# EAGLE design TempSensorCircuit_v3 (EAGLE 9.5.1)

## Sheet 1 of 2
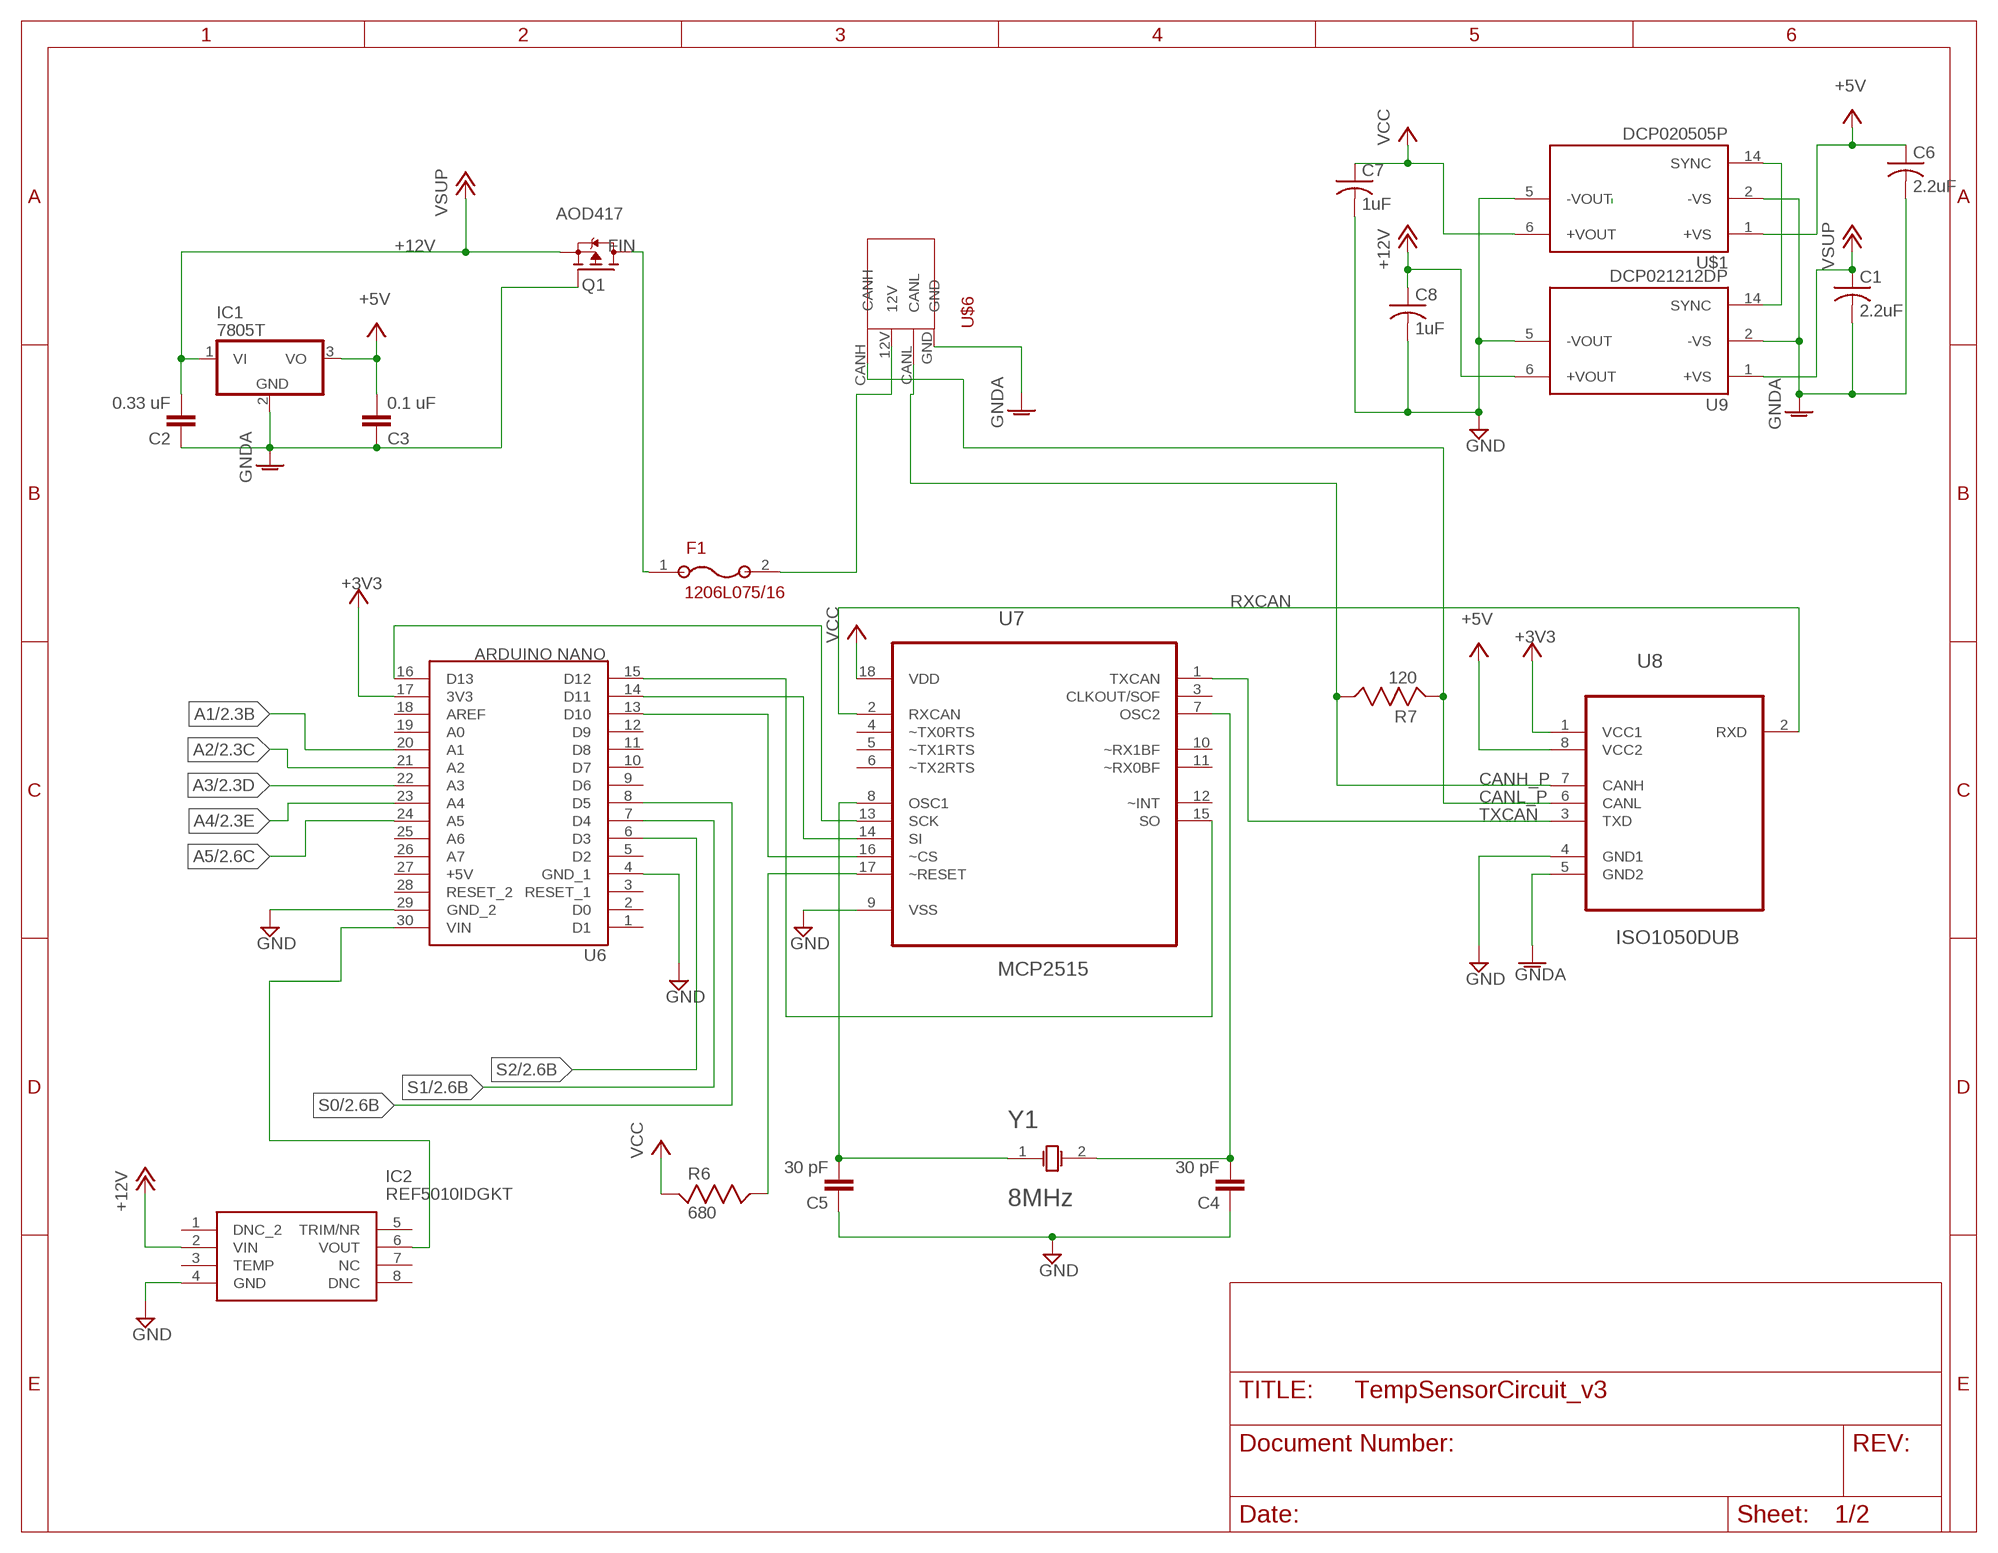
[diagram p0: schematic, sheet 1]

### Parts
C1  2.2uF  C-USC0805  [C0805]
C2  0.33 uF  C5/2.5  [C5B2.5]
C3  0.1 uF  C5/2.5  [C5B2.5]
C4  30 pF  C5/2.5  [C5B2.5]
C5  30 pF  C5/2.5  [C5B2.5]
C6  2.2uF  C-USC0805  [C0805]
C7  1uF  C-USC0805  [C0805]
C8  1uF  C-USC0805  [C0805]
F1  1206L075/16  [1206L075/16]
IC1  7805T  [TO220H]
IC2  REF5010IDGKT  [SOP65P490X110-8N]
Q1  AOD417  FDD4141TO252  [TO252]
R6  680  RC0805FR-0751K1L  [RESC2012X60]
R7  120  RC0805FR-0751K1L  [RESC2012X60]
U6  ARDUINO NANO  NANO  [NANO]
U7  MCP2515  MCP2515-I/P  [DIP254P762X432-18]
U8  ISO1050DUB  [SOP254P1040X485-8N]
U9  DCP021212DP  [DIP763W46P254L1969H533Q14]
U$1  DCP020505P  [DIP763W46P254L1969H533Q14]
U$6  0026013142-ND  [0026013142-ND]
Y1  8MHz  HC49/SLF  [XTAL_HC49P488W43L1135T465H360]

### Nets
+3V3: U6.17(3V3) U8.1(VCC1)
+5V: C3.2 C6.1 IC1.3(VO) U8.8(VCC2) U$1.1(+VS)
+12V: C1.1 C2.2 C8.1 IC1.1(VI) IC2.2(VIN) Q1.2(S) U9.1(+VS) U9.6(+VOUT) ; supply symbol labelled VSUP
A1: U6.20(A1) ; also sheet 2
A2: U6.21(A2) ; also sheet 2
A3: U6.22(A3) ; also sheet 2
A4: U6.23(A4) ; also sheet 2
A5: U6.24(A5) ; also sheet 2
CANH_P: R7.2 U8.7(CANH) U$6.CANL
CANL_P: R7.1 U8.6(CANL) U$6.CANH
FIN: F1.1 Q1.3(D)
GND: C4.1 C5.1 C7.2 C8.2 IC2.4(GND) U6.4(GND_1) U6.29(GND_2) U7.9(VSS) U8.4(GND1) U9.5(-VOUT) U$1.5(-VOUT) ; also sheet 2
GNDA: C1.2 C2.1 C3.1 C6.2 IC1.2(GND) Q1.1(G) U8.5(GND2) U9.2(-VS) U$1.2(-VS) U$6.GND
N$1: R6.2 U7.17(~RESET)
N$3: U6.16(D13) U7.13(SCK)
N$7: U6.14(D11) U7.14(SI)
N$8: U6.15(D12) U7.15(SO)
N$9: U6.13(D10) U7.16(~CS)
N$10: IC2.6(VOUT) U6.30(VIN)
N$18: F1.2 U$6.12V
N$53: U9.14(SYNC) U$1.14(SYNC)
OSC_N [DiffPair]: C5.2 U7.8(OSC1) Y1.1
OSC_P [DiffPair]: C4.2 U7.7(OSC2) Y1.2
RXCAN: U7.2(RXCAN) U8.2(RXD)
S0: U6.8(D5) ; also sheet 2
S1: U6.7(D4) ; also sheet 2
S2: U6.6(D3) ; also sheet 2
TXCAN: U7.1(TXCAN) U8.3(TXD)
VCC: C7.1 R6.1 U7.18(VDD) U$1.6(+VOUT) ; also sheet 2
Unconnected: IC2.1(DNC_2) IC2.3(TEMP) IC2.5(TRIM/NR) IC2.7(NC) IC2.8(DNC) U6.1(D1) U6.2(D0) U6.3(RESET_1) U6.5(D2) U6.9(D6) U6.10(D7) U6.11(D8) U6.12(D9) U6.18(AREF) U6.19(A0) U6.25(A6) U6.26(A7) U6.28(RESET_2) U7.3(CLKOUT/SOF) U7.4(~TX0RTS) U7.5(~TX1RTS) U7.6(~TX2RTS) U7.10(~RX1BF) U7.11(~RX0BF) U7.12(~INT)

## Sheet 2 of 2
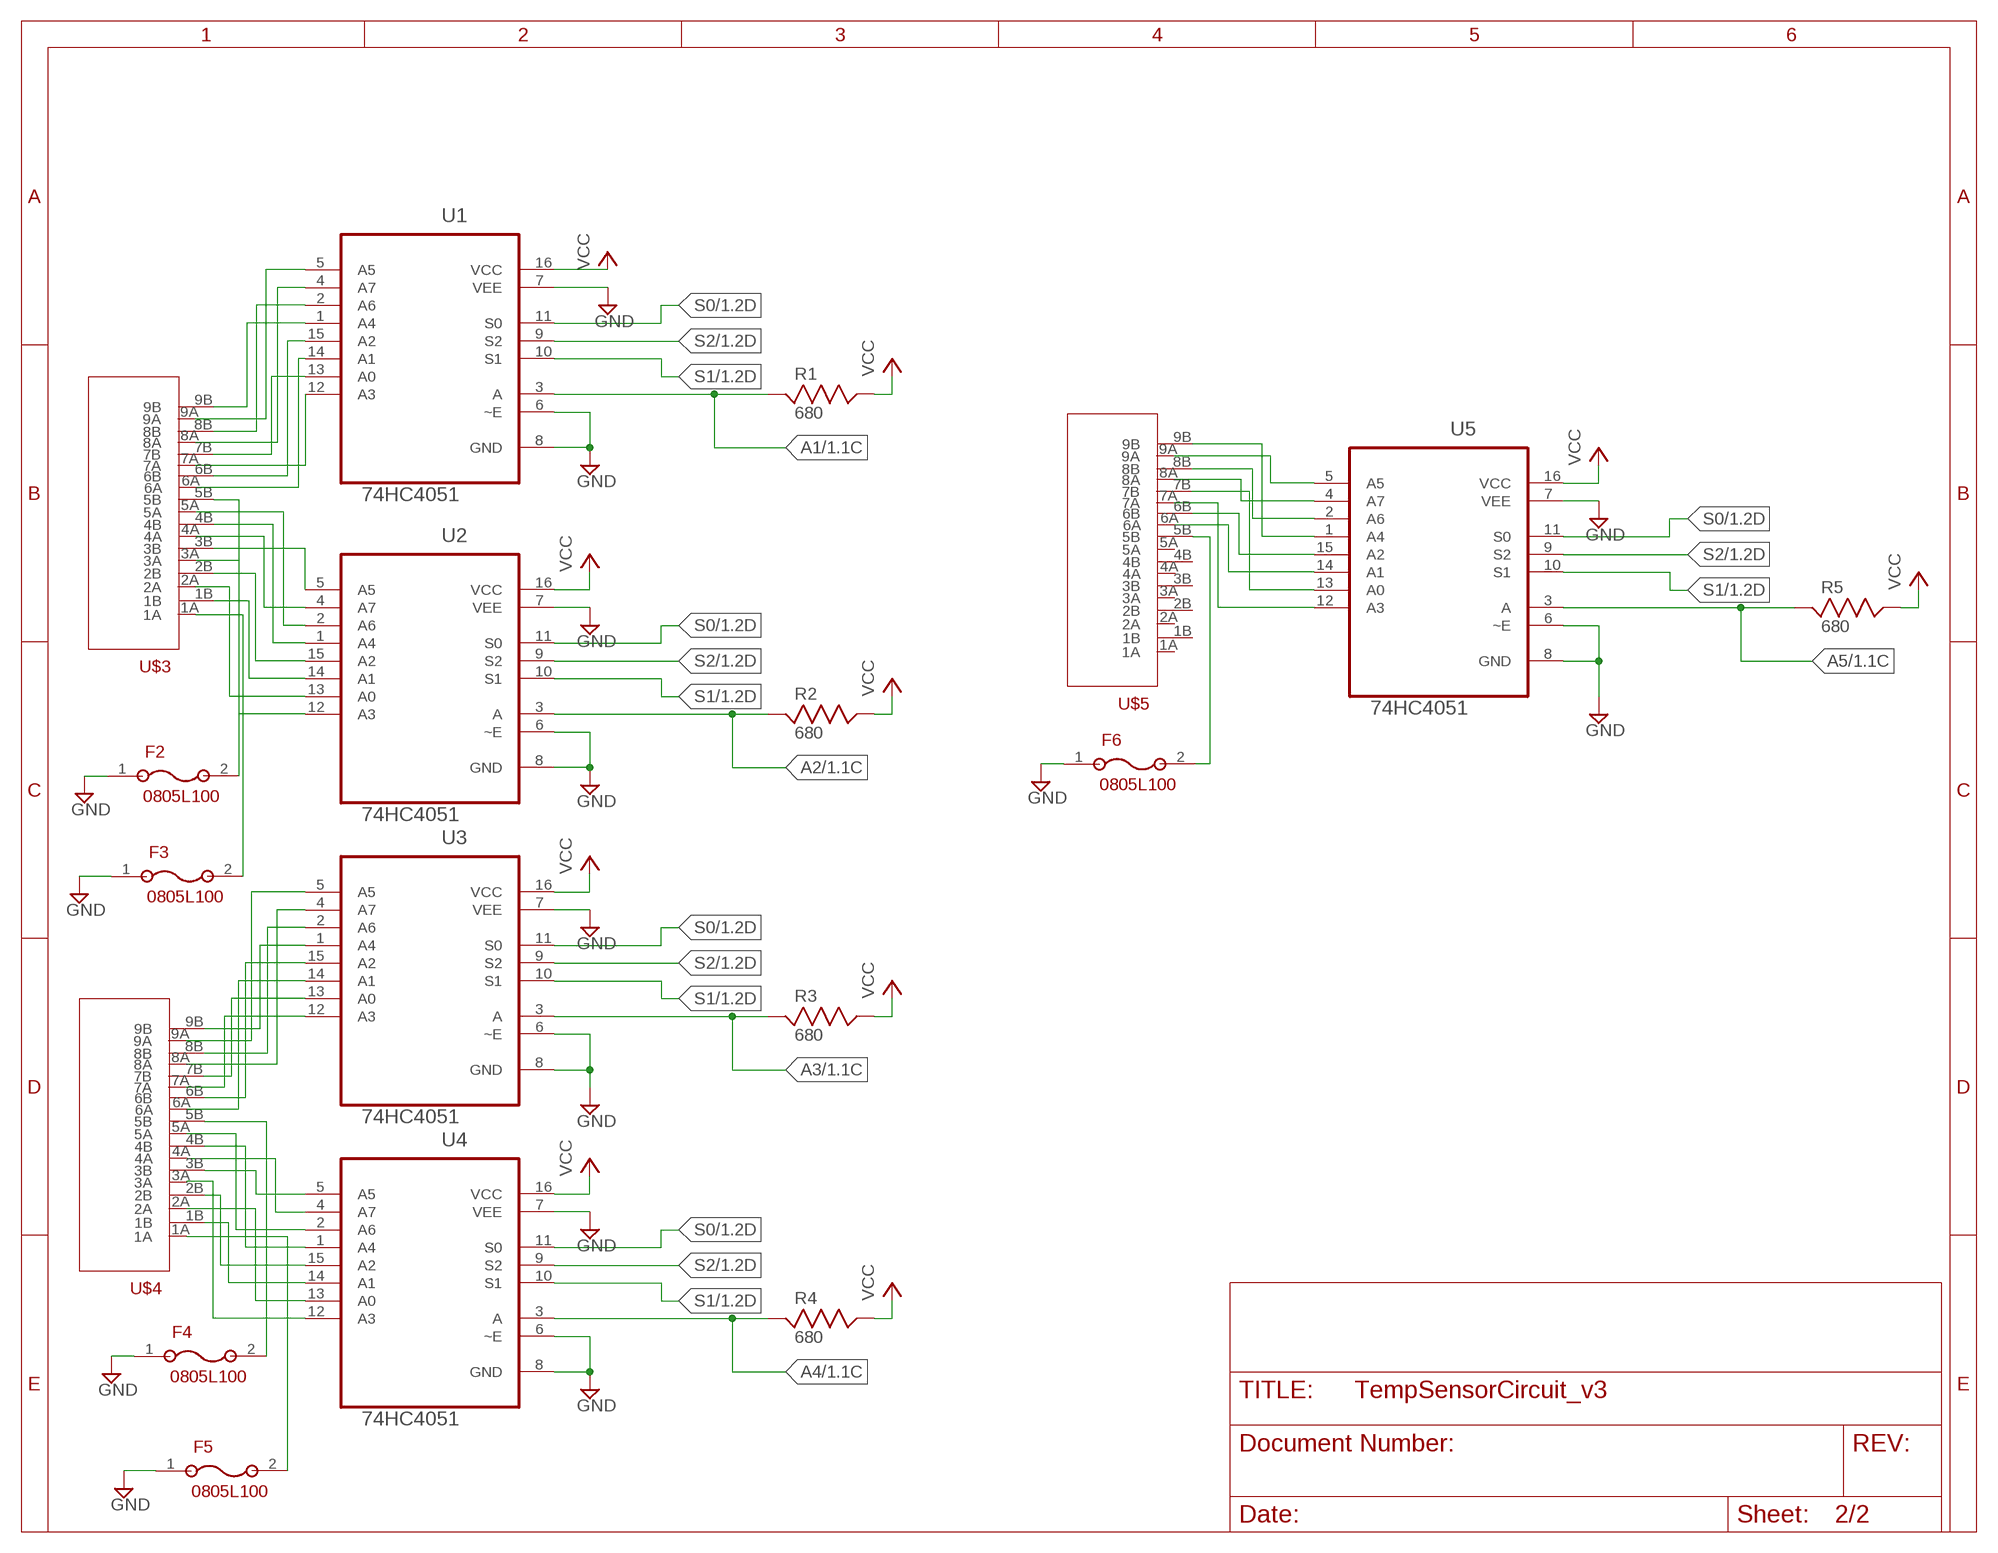
[diagram p1: schematic, sheet 2]

### Parts
F2  0805L100  [2012]
F3  0805L100  [2012]
F4  0805L100  [2012]
F5  0805L100  [2012]
F6  0805L100  [2012]
R1  680  RC0805FR-0751K1L  [RESC2012X60]
R2  680  RC0805FR-0751K1L  [RESC2012X60]
R3  680  RC0805FR-0751K1L  [RESC2012X60]
R4  680  RC0805FR-0751K1L  [RESC2012X60]
R5  680  RC0805FR-0751K1L  [RESC2012X60]
U1  74HC4051  CD74HC4051E  [DIP254P762X508-16]
U2  74HC4051  CD74HC4051E  [DIP254P762X508-16]
U3  74HC4051  CD74HC4051E  [DIP254P762X508-16]
U4  74HC4051  CD74HC4051E  [DIP254P762X508-16]
U5  74HC4051  CD74HC4051E  [DIP254P762X508-16]
U$3  WM1359-ND  [WM1359-ND]
U$4  WM1359-ND  [WM1359-ND]
U$5  WM1359-ND  [WM1359-ND]

### Nets
A1: R1.1 U1.3(A) ; also sheet 1
A2: R2.1 U2.3(A) ; also sheet 1
A3: R3.1 U3.3(A) ; also sheet 1
A4: R4.1 U4.3(A) ; also sheet 1
A5: R5.1 U5.3(A) ; also sheet 1
GND: F2.1 F3.1 F4.1 F5.1 F6.1 U1.6(~E) U1.7(VEE) U1.8(GND) U2.6(~E) U2.7(VEE) U2.8(GND) U3.6(~E) U3.7(VEE) U3.8(GND) U4.6(~E) U4.7(VEE) U4.8(GND) U5.6(~E) U5.7(VEE) U5.8(GND) ; also sheet 1
N$2: U1.1(A4) U$3.9B
N$4: U1.2(A6) U$3.8B
N$5: U1.5(A5) U$3.9A
N$6: U1.4(A7) U$3.8A
N$11: U1.15(A2) U$3.6B
N$12: U1.14(A1) U$3.6A
N$13: U1.13(A0) U$3.7B
N$14: U1.12(A3) U$3.7A
N$15: U2.2(A6) U$3.5A
N$16: U2.1(A4) U$3.4B
N$17: U2.4(A7) U$3.4A
N$19: U2.5(A5) U$3.3B
N$20: U2.15(A2) U$3.2B
N$21: U2.14(A1) U$3.1B
N$22: U2.12(A3) U$3.3A
N$23: U2.13(A0) U$3.2A
N$24: F2.2 U$3.5B
N$25: F3.2 U$3.1A
N$26: U3.1(A4) U$4.9B
N$27: U3.2(A6) U$4.8B
N$28: U3.4(A7) U$4.8A
N$29: U3.5(A5) U$4.9A
N$30: U3.15(A2) U$4.6B
N$31: U3.14(A1) U$4.6A
N$32: U3.13(A0) U$4.7B
N$33: U3.12(A3) U$4.7A
N$34: F4.2 U$4.5B
N$35: U4.1(A4) U$4.4B
N$36: U4.2(A6) U$4.5A
N$37: U4.4(A7) U$4.4A
N$38: U4.5(A5) U$4.3B
N$39: U4.15(A2) U$4.2B
N$40: U4.14(A1) U$4.1B
N$41: U4.13(A0) U$4.2A
N$42: U4.12(A3) U$4.3A
N$43: F5.2 U$4.1A
N$44: U5.1(A4) U$5.9B
N$45: U5.2(A6) U$5.8B
N$46: U5.4(A7) U$5.8A
N$47: U5.5(A5) U$5.9A
N$48: U5.15(A2) U$5.6B
N$49: U5.14(A1) U$5.6A
N$50: U5.13(A0) U$5.7B
N$51: U5.12(A3) U$5.7A
N$52: F6.2 U$5.5B
S0: U1.11(S0) U2.11(S0) U3.11(S0) U4.11(S0) U5.11(S0) ; also sheet 1
S1: U1.10(S1) U2.10(S1) U3.10(S1) U4.10(S1) U5.10(S1) ; also sheet 1
S2: U1.9(S2) U2.9(S2) U3.9(S2) U4.9(S2) U5.9(S2) ; also sheet 1
VCC: R1.2 R2.2 R3.2 R4.2 R5.2 U1.16(VCC) U2.16(VCC) U3.16(VCC) U4.16(VCC) U5.16(VCC) ; also sheet 1
Unconnected: U$5.1A U$5.1B U$5.2A U$5.2B U$5.3A U$5.3B U$5.4A U$5.4B U$5.5A

## Power pins joined to a net without a drawn wire
+5V: U6.27(+5V)

## Library data of the parts
C1 C6-C8 = rcl:C-US: CAPACITOR, American symbol; SPICEPREFIX: C
C2-C5 = capacitor-wima:C: CAPACITOR naming: grid - package width
F1 = 1206L:1206L075/16
F2-F6 = 0805L:0805L100
IC1 = linear:78*: Positive VOLTAGE REGULATOR Source: http://cache.national.com/ds/LM/LM78L05.pdf http://www.fairchildsemi.com/ds/LM/LM7805.pdf
IC2 = SamacSys_Parts:REF5010IDGKT: Low Noise, Very Low Drift, Precision Series Voltage Reference Source: Datasheet <http://www.ti.com/lit/gpn/ref5010>; DESCRIPTION: Low Noise, Very Low Drift, Precision Series Voltage Reference; HEIGHT: mm; MANUFACTURER_NAME: Texas Instruments; MANUFACTURER_PART_NUMBER: REF5010IDGKT; MOUSER_PART_NUMBER: 595-REF5010IDGKT; MOUSER_PRICE-STOCK: https://www.mouser.com/Search/Refine.aspx?Keyword=595-REF5010IDGKT
Q1 = AOD417:FDD4141: P-Channel PowerTrench® MOSFET Source: FDD4141.pdf; AVAILABILITY: Unavailable; DESCRIPTION: Transistor: P-MOSFET; unipolar; -40V; -50A; 69W; DPAK; MF: ON Semiconductor; MP: FDD4141; PACKAGE: TO-252-3 Fairchild Semiconductor; PRICE: None
R1-R7 = RC0805FR-0751K1L:RC0805FR-0751K1L: RC Series 0805 0.125 W 2 kOhms 5% ±100 ppm/°C SMT Thick Film Chip Resistor; AVAILABILITY: Unavailable; DESCRIPTION: Res Thick Film 2.0 x 1.2 mm 51.1K Ohm 1% 0.125W_1/8W_ 100ppm/ C Molded SMD Paper T/R; MF: Yageo; MP: RC0805FR-0751K1L; PACKAGE: 0805 Yageo; PRICE: None
U1-U5 = CD74HC4051E:CD74HC4051E: HIGH-SPEED CMOS LOGIC ANALOG MULTIPLEXERS/DEMULTIPLEXERS; AVAILABILITY: Unavailable; DESCRIPTION: High Speed CMOS 8-Channel Analog Multiplexer/Demultiplexer 16-PDIP -55 to 125; MF: Texas Instruments; MP: CD74HC4051E; PACKAGE: PDIP-16 Texas Instruments; PRICE: None
U6 = ArduinoNano:NANO: MICRO, ARDUINO NANO 3.0, MINI-B USB, ATmega328, 0.1"DIP, ICSP HDR; AVAILABILITY: Unavailable; DESCRIPTION: MICRO, ARDUINO NANO 3.0, MINI-B USB, ATmega328, 0.1DIP, ICSP HDR; MF: Arduino; MP: A000005; PACKAGE: None; PRICE: None
U7 = MCP2515-I_P:MCP2515-I/P: Stand-Alone CAN Controller; AVAILABILITY: Unavailable; DESCRIPTION: MCP2515 Series 5.5 V 1 Mb/s Stand Alone SPI Interface CAN Controller - PDIP-18; MF: Microchip; MP: MCP2515-I/P; PACKAGE: DIP-18 Microchip; PRICE: None
U8 = ISO1050DUB:ISO1050DUB: ISOLATED CAN TRANSCEIVER; AVAILABILITY: Unavailable; DESCRIPTION: Isolated 5-V CAN Transceivers 8-SOP -55 to 105; MF: Texas Instruments; MP: ISO1050DUB; PACKAGE: SOP-8 Texas Instruments; PRICE: None
U9 = DCP021212DP:DCP021212DP: Miniature, 2W Isolated Unregulated DC/DC Converters 7-PDIP -40 to 85; DESCRIPTION: Miniature, 2W Isolated Unregulated DC/DC Converters 7-PDIP -40 to 85; DIGI-KEY_PART_NUMBER: DCP021212DP-ND; DIGI-KEY_PURCHASE_URL: https://www.digikey.ca/product-detail/en/texas-instruments/DCP021212DP/DCP021212DP-ND/307873?utm_source=snapeda&utm_medium=aggregator&utm_campaign=symbol; MF: Texas Instruments; MP: DCP021212DP; PACKAGE: PDIP-7 Texas Instruments
U$1 = DCP021212DP:DCP020505P
U$3-U$5 = WM21358-ND:WM1359-ND
U$6 = WM21358-ND:0026013142-ND
Y1 = XTAL_HC49P488W43L1135T465H360:HC49/SLF

## Net classes
0 default: width 0.5 mm, clearance 0.2 mm
1 DiffPair: width 0.305 mm, clearance 0.2 mm

## Board
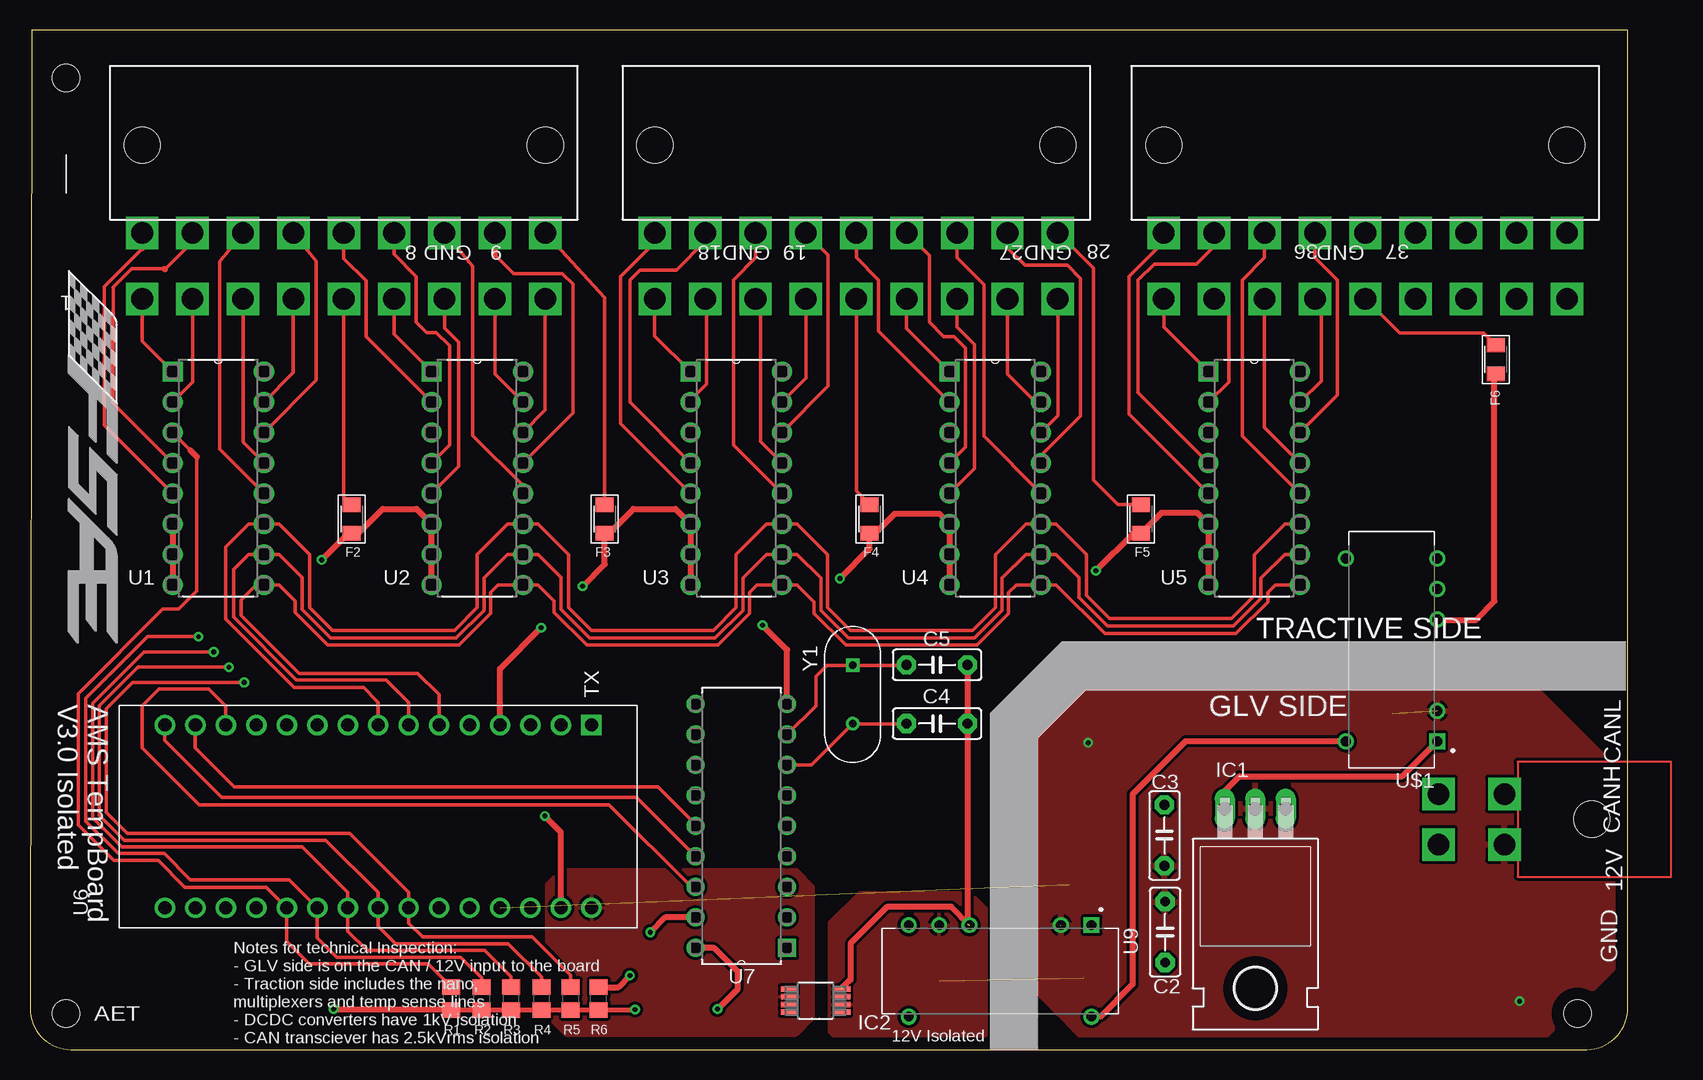
[diagram p2: board, top side]
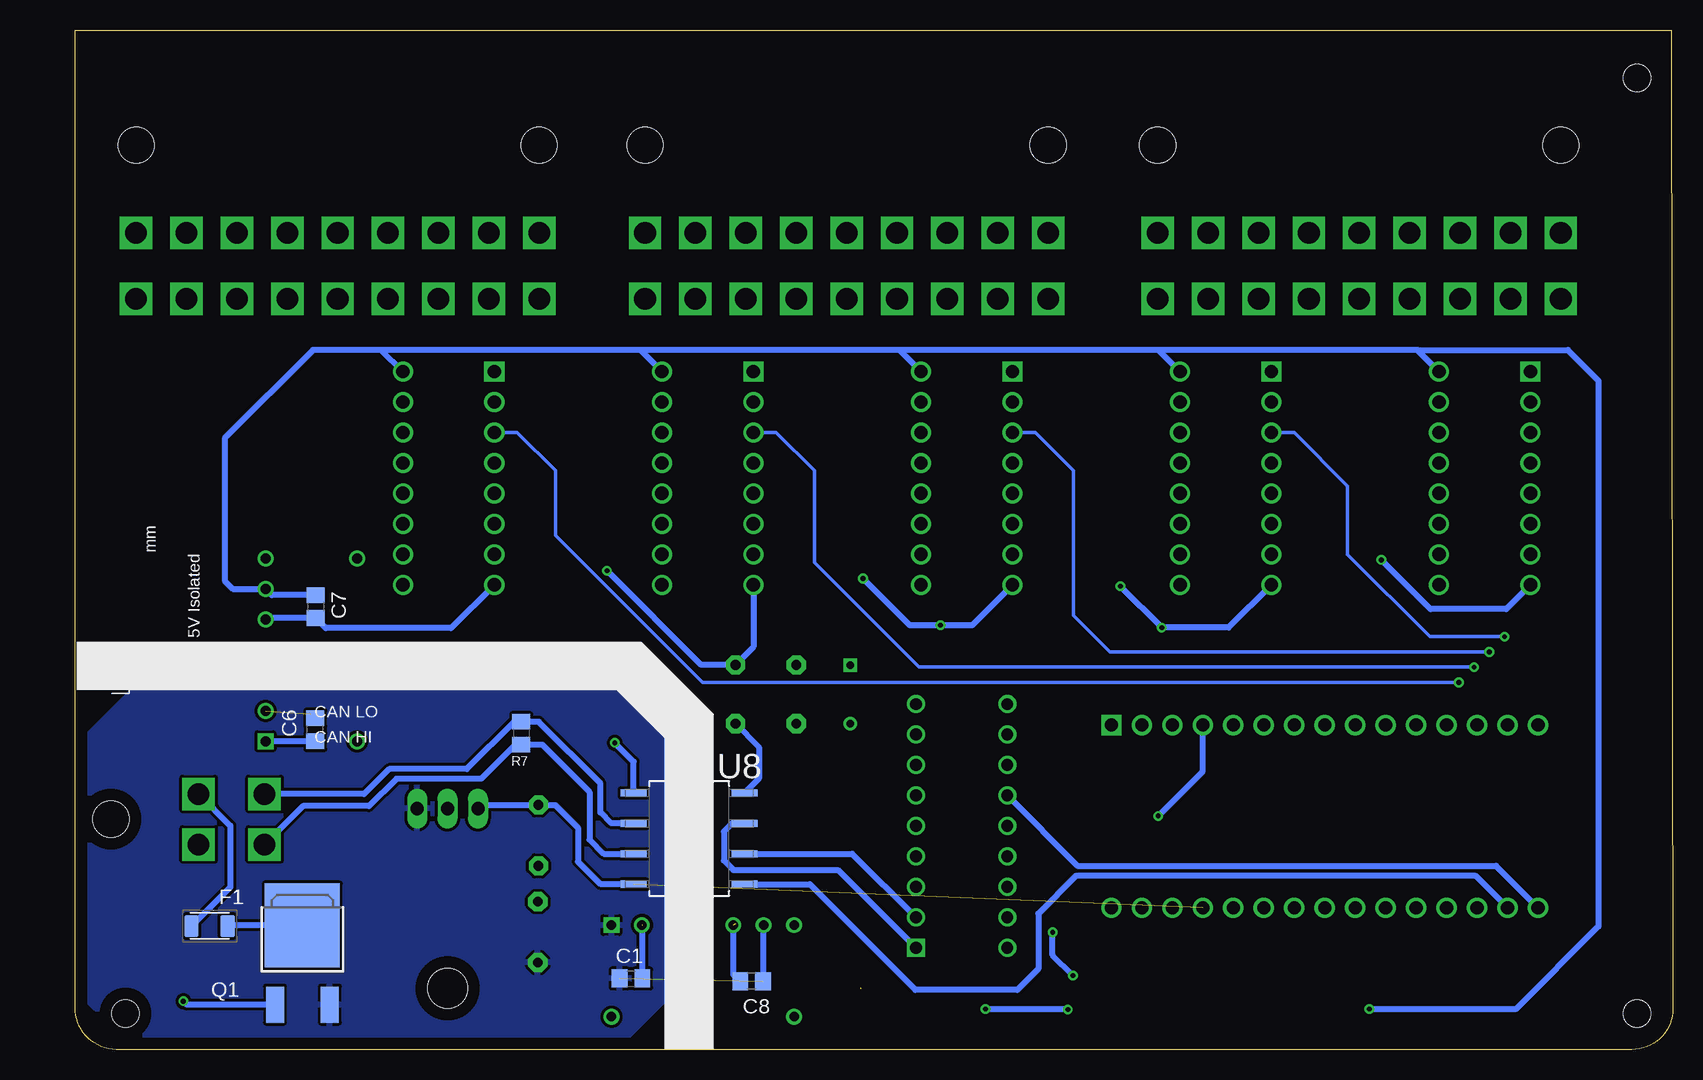
[diagram p3: board, bottom side, seen from below]

Size 133.19 x 85 mm. Coordinates in mm from the lower left corner, seen from the top.
Outline: 133.18,85 0.15,85 0,3.41 arc90 3.41,0 129.78,0 arc90 133.19,3.5 133.18,85
Copper layers (1*16): Top 0.035mm / dielectric 2mm / Bottom 0.035mm
Design rules "default *": minimum track width 6mil, minimum drill 0.4mm, track to track 10mil, track to pad 10mil, pad to pad 10mil, via to via 10mil, smd to smd 6mil, copper to edge 40mil, drill to drill 6mil, minimum pad ring 10mil, minimum via ring 8mil, stop-mask expansion 4mil, vias tented up to drill 0mil, thermal gap 10mil
Holes 2.25 mm at 3,81 129,3 3,3

### Footprints (pad centres in the part's own frame; a part is rotated, then mirrored left to right if it is on the bottom)
C0805 = smd 1.3 x 1.5: 1 -0.95,0; 2 0.95,0
C5B2.5 = drill 0.813 pad 1.6 octagon: 1 -2.54,0; 2 2.54,0
1206L075/16 = smd 1.2 x 1.82: 1 -1.505,0; 2 1.505,0
2012 = smd 1.2 x 1.5: 1 -1.2,0; 2 1.2,0
TO220H = drill 1.118 long: 1 -2.54,-10.16; 2 0,-10.16; 3 2.54,-10.16 | hole 3.302: 0,4.826
SOP65P490X110-8N = smd 1.372 x 0.457: 1 -2.21,0.965; 2 -2.21,0.33; 3 -2.21,-0.33; 4 -2.21,-0.965; 5 2.21,-0.965; 6 2.21,-0.33; 7 2.21,0.33; 8 2.21,0.965
TO252 = smd 1.5 x 3: 1 -2.286,-6.6; 2 2.28,-6.6 | smd 6.25 x 7: 3 0,0
RESC2012X60 = smd 1.3 x 1.5: 1 -0.95,0; 2 0.95,0
DIP254P762X508-16 = drill 1.118 square: 1 -7.62,17.78 | drill 1.118: 2 -7.62,15.24; 3 -7.62,12.7; 4 -7.62,10.16; 5 -7.62,7.62; 6 -7.62,5.08; 7 -7.62,2.54; 8 -7.62,0; 9 0,0; 10 0,2.54; 11 0,5.08; 12 0,7.62; 13 0,10.16; 14 0,12.7; 15 0,15.24; 16 0,17.78
NANO = drill 1.1 pad 1.7 square: 1 -7.62,17.78 | drill 1.1 pad 1.7: 2 -7.62,15.24; 3 -7.62,12.7; 4 -7.62,10.16; 5 -7.62,7.62; 6 -7.62,5.08; 7 -7.62,2.54; 8 -7.62,0; 9 -7.62,-2.54; 10 -7.62,-5.08; 11 -7.62,-7.62; 12 -7.62,-10.16; 13 -7.62,-12.7; 14 -7.62,-15.24; 15 -7.62,-17.78; 16 7.62,-17.78; 17 7.62,-15.24; 18 7.62,-12.7; 19 7.62,-10.16; 20 7.62,-7.62; 21 7.62,-5.08; 22 7.62,-2.54; 23 7.62,0; 24 7.62,2.54; 25 7.62,5.08; 26 7.62,7.62; 27 7.62,10.16; 28 7.62,12.7; 29 7.62,15.24; 30 7.62,17.78
DIP254P762X432-18 = drill 0.991 square: 1 -7.62,20.32 | drill 0.991: 2 -7.62,17.78; 3 -7.62,15.24; 4 -7.62,12.7; 5 -7.62,10.16; 6 -7.62,7.62; 7 -7.62,5.08; 8 -7.62,2.54; 9 -7.62,0; 10 0,0; 11 0,2.54; 12 0,5.08; 13 0,7.62; 14 0,10.16; 15 0,12.7; 16 0,15.24; 17 0,17.78; 18 0,20.32
SOP254P1040X485-8N = smd 2.159 x 0.61: 1 -4.623,3.81; 2 -4.623,1.27; 3 -4.623,-1.27; 4 -4.623,-3.81; 5 4.623,-3.81; 6 4.623,-1.27; 7 4.623,1.27; 8 4.623,3.81
DIP763W46P254L1969H533Q14 = drill 0.82 square: 1 -3.815,7.62 | drill 0.82: 2 -3.815,5.08; 5 -3.815,-2.54; 6 -3.815,-5.08; 7 -3.815,-7.62; 8 3.815,-7.62; 14 3.815,7.62
WM1359-ND = drill 1.8 square: 1A 36.3,-1.1; 1B 36.3,-6.6; 2A 32.1,-1.1; 2B 32.1,-6.6; 3A 27.9,-1.1; 3B 27.9,-6.6; 4A 23.7,-1.1; 4B 23.7,-6.6; 5A 19.5,-1.1; 5B 19.5,-6.6; 6A 15.3,-1.1; 6B 15.3,-6.6; 7A 11.1,-1.1; 7B 11.1,-6.6; 8A 6.9,-1.1; 8B 6.9,-6.6; 9A 2.7,-1.1; 9B 2.7,-6.6 | hole 3: 2.7,6.2; 36.3,6.2
0026013142-ND = drill 1.8 square: 12V 2.7,-1.1; CANH 2.7,-6.6; CANL 6.9,-6.6; GND 6.9,-1.1 | hole 3: 4.8,6.2
XTAL_HC49P488W43L1135T465H360 = drill 0.63 pad 1.03 square: 1 -2.44,0 | drill 0.63 pad 1.03: 2 2.44,0

### Placement (x,y rotation side)
C1  86.86,5.92 0 bottom
C2  94.62,9.79 270 top
C3  94.57,17.85 90 top
C4  75.61,27.17 180 top
C5  75.61,32.07 180 top
C6  113.17,26.66 90 bottom
C7  113.14,36.93 270 bottom
C8  76.8,5.69 180 bottom
F1  121.98,10.3 180 bottom
F2  26.82,44.23 90 top
F3  47.9,44.23 90 top
F4  70,44.23 90 top
F5  92.6,44.23 90 top
F6  122.19,57.53 90 top
IC1  102.14,9.93 180 top
IC2  65.49,4.08 180 top
Q1  114.25,10.33 0 bottom
R1  35.1,4.25 270 top
R2  37.65,4.25 270 top
R3  40.09,4.25 270 top
R4  42.62,4.25 270 top
R5  45.06,4.25 270 top
R6  47.41,4.25 90 top
R7  96,26.37 270 bottom
U1  19.5,38.74 0 top
U2  41.09,38.74 0 top
U3  62.68,38.74 0 top
U4  84.27,38.74 0 top
U5  105.86,38.74 0 top
U6  29.02,19.43 270 top
U7  55.49,28.8 180 top
U8  82.01,17.59 180 bottom
U9  80.87,6.56 270 top
U$1  113.5,33.32 180 top
U$3  6.65,69.19 0 top
U$4  49.38,69.19 0 top
U$5  91.81,69.19 0 top
U$6  124,24 270 top
Y1  68.57,29.59 270 top

### Tracks (layer width: path | path; a pad name or v marks a point on that pad's centre or on a via)
+3V3
  Bottom 0.5: U6.17 16.49,14.52 49.71,14.52 52.91,11.32 52.91,6.72 54.66,4.97 63.14,4.97 71.95,13.78 U8.1
+5V  (1 unrouted)
  Top 0.5: IC1.3 99.6,21.56 100.82,22.78 114.39,22.78 U$1.1
  Bottom 0.5: 99.3,20.39 IC1.3 99.3,20.39 | U8.8 89.39,13.78 91.27,15.66 91.27,18.49 93.17,20.39 C3.2 99.3,20.39 | C6.1 113.38,25.5 113.6,25.5 113.8,25.7 U$1.1
+12V  (1 unrouted)
  Bottom 0.5: U9.6 75.85,10.31 C8.1
  pour Bottom: 89.99,-1.74 83.1,5.15 83.1,26.26 87.81,30.97 89.46,30.97 127.3,30.97 135.5,22.77 135.5,7.49 127.31,-0.7 126.09,-1.92 90.33,-1.92
  pour Top: 66.66,1.63 66.66,10.59 69.15,13.08 78.39,13.08 79.7,11.77 79.7,1.17 78.64,0.11 68,0.11 66.66,1.45
A1
  Top 0.305: 13.36,49.96 U1.3 | R1.1 35.1,5.22 33.18,7.14 23.26,7.14 21.41,9 U6.20 19.7,13.53 12.9,13.53 10.67,15.76 6.99,15.76 4,18.75 4,29.66 11.08,36.73 12.38,36.73 13.9,38.25 13.9,49.42
  Top 0.5: 13.9,49.42 13.36,49.96
A2  (via drill 0.4)
  Top 0.305: 14.03,34.41 v14.04,34.42 9.81,34.42 4.66,29.27 4.66,19.01 7.34,16.33 11.17,16.33 13.34,14.16 21.59,14.16 U6.21 23.95,9.31 25.55,7.7 35.91,7.7 37.65,5.97 R2.1
  Bottom 0.305: U2.3 31.57,51.44 27.12,46.99 27.12,41.28 20.26,34.42 v14.04,34.42
A3  (via drill 0.4)
  Top 0.305: v15.31,33.15 9.51,33.15 5.22,28.86 5.22,19.3 7.63,16.89 22.68,16.89 26.48,13.09 U6.22 26.48,9.87 28.09,8.26 37.89,8.26 40.09,6.07 R3.1
  Bottom 0.305: U3.3 53.16,51.44 49.98,48.26 49.98,36.2 46.93,33.15 v15.31,33.15
A4  (via drill 0.4)
  Top 0.305: v16.58,31.88 9.03,31.88 5.78,28.63 5.78,19.53 7.86,17.45 24.66,17.45 29.02,13.09 U6.23 29.02,10.27 30.48,8.82 39.87,8.82 42.62,6.07 R4.1
  Bottom 0.305: U4.3 74.75,51.44 71.57,48.26 71.57,40.6 62.85,31.88 v16.58,31.88
A5  (via drill 0.4)
  Top 0.305: v17.85,30.61 8.55,30.61 6.34,28.4 6.34,19.76 8.09,18.01 26.64,18.01 31.57,13.09 U6.24 31.57,10.53 32.71,9.38 41.85,9.38 45.06,6.17 R5.1
  Bottom 0.305: U5.3 96.33,51.44 93.16,48.26 93.16,42.87 80.9,30.61 v17.85,30.61
CANH_P
  Bottom 0.5: 85.76,16.32 U8.7 89.12,16.32 90.31,17.51 90.31,21.47 94.26,25.42 R7.2 96.49,25.42 99.33,22.58 106.41,22.58 108.69,20.3 114.2,20.3 U$6.CANL
CANL_P
  Bottom 0.5: U8.6 88.5,18.86 89.4,19.76 89.4,22.17 94.55,27.32 R7.1 96.62,27.32 100.55,23.39 107.01,23.39 109.1,21.3 U$6.CANH
FIN
  Bottom 0.5: F1.1 120.44,10.33 Q1.3 112.67,10.33
GND  (via drill 0.4)  (2 unrouted)
  Top 0.5: U1.6 U1.7 U1.8 | U2.8 U2.7 U2.6 32.22,45.07 29.41,45.07 27.37,43.03 F2.1 26.52,43.03 v24.31,40.82 | U4.8 U4.7 U4.6 75.8,44.67 72.09,44.67 70.45,43.03 F4.1 70,41.76 v67.51,39.27 | U3.8 U3.7 U3.6 53.81,45.07 50.29,45.07 48.25,43.03 F3.1 47.9,40.46 v46.06,38.62 | U5.8 U5.7 U5.6 97.29,44.77 94.35,44.77 F5.1 91.97,43.03 v88.86,39.92 | U7.9 63.11,33.32 v61.06,35.37 | U6.29 44.27,18.11 v42.91,19.47 | U6.4 39.19,31.75 v42.61,35.17 | C5.1 C4.1 78.15,10.47 | F6.1 122.08,56.22 122.08,37.37 120.5,35.79 117.39,35.79 U$1.5 | U9.5 76.78,11.92 71.48,11.92 68.4,8.84 68.4,5.84 67.7,5.14
  Bottom 0.5: U1.8 13.9,36.72 20.21,36.72 v24.31,40.82 | U2.8 37.04,35.17 v42.61,35.17 v46.06,38.62 | U3.8 58.43,35.37 v61.06,35.37 63.61,35.37 v67.51,39.27 | U4.8 76.65,33.57 C5.1 81.01,32.07 v88.86,39.92 | v42.91,19.47 39.19,23.2 U6.4 | U8.4 76.19,22.6 76.19,25.2 C4.1 | U5.8 101.85,35.13 112.29,35.13 C7.2 117.19,35.98 U$1.5 | U9.5 78.33,6.27 C8.2
GNDA  (via drill 0.4)  (2 unrouted)
  Bottom 0.5: C3.1 94.62,15.26 | U8.5 86.63,23.99 v88.21,25.57 | C6.2 113.55,27.99 | C1.2 85.91,10.34 | Q1.1 123.87,3.73 v124.17,4.03
  pour Top: 88.87,-0.09 84.25,4.53 84.25,25.99 88.09,29.83 125.76,29.83 133.43,22.16 133.43,8.29 124.89,-0.25 88.84,-0.25
N$1  (via drill 0.4)
  Top 0.5: U7.17 52.95,11.02 v51.71,9.77 | R6.2 49.04,5.2 v50.01,6.17
  Bottom 0.5: v50.01,6.17 51.71,7.87 v51.71,9.77
N$2
  Top 0.305: U1.1 9.35,59.05 U$3.9B
N$3
  Bottom 0.5: U7.13 49.64,15.32 14.76,15.32 U6.16
N$4
  Top 0.305: U1.2 13.55,55.65 U$3.8B
N$5
  Top 0.305: 9.35,66.78 6.19,63.61 6.19,52.05 U1.5
  Top 0.5: 9.35,66.78 U$3.9A
N$6
  Top 0.305: U1.4 6.94,53.84 6.94,63.57 8.46,65.09 11.22,65.09 | 11.26,65.05 13.55,67.34
  Top 0.5: 11.22,65.09 11.26,65.05 | 13.55,67.34 U$3.8A
N$7
  Top 0.305: U6.14 13.79,25.15 17.04,21.9 52.35,21.9 55.49,18.76 U7.14
N$8
  Top 0.305: U6.15 11.24,25.79 15.99,21.04 50.55,21.04 U7.15
N$9
  Top 0.305: U6.13 16.32,28.63 14.9,30.05 10.76,30.05 9.34,28.63 9.34,25.15 14.09,20.41 48.27,20.41 55.12,13.55 U7.16
N$10
  pour Top: 63.98,1.28 65.29,2.59 65.29,13.6 63.92,14.97 44.23,14.97 43.05,13.79 43.05,2.9 43,2.85 44.68,1.17 63.81,1.17
N$11
  Top 0.305: U1.15 21.95,56.43 U$3.6B
N$12
  Top 0.305: U1.14 23.87,55.81 23.87,65.72 U$3.6A
N$13
  Top 0.305: U1.13 17.75,50.65 U$3.7B
N$14
  Top 0.305: U1.12 15.8,50.06 15.8,65.69 U$3.7A
N$15
  Top 0.305: U2.2 28,59.45 28,64.1 26.15,65.95 U$3.5A
N$16
  Top 0.305: U2.1 30.35,59.64 U$3.4B
N$17
  Top 0.305: U2.4 34.96,50.39 34.96,58.68 33.86,59.78 33.06,59.78 32.2,60.64 32.2,64.45 30.35,66.3 U$3.4A
N$18
  Bottom 0.5: F1.2 120.26,13.53 120.26,18.66 U$6.12V
N$19
  Top 0.305: U$3.3B 34.55,60.16 35.71,58.99 35.71,48.6 U2.5
N$20
  Top 0.305: U2.15 38.75,56.32 U$3.2B
N$21
  Top 0.305: U2.14 42.95,53.3 U$3.1B
N$22
  Top 0.305: U$3.3A 36.9,65.29 36.9,51.2 41.09,47
  Top 0.5: U2.12 41.09,47
N$23
  Top 0.305: U2.13 45.25,53.06 45.25,63.81 44.36,64.7 40.3,64.7 38.75,66.25
  Top 0.5: 38.75,66.25 U$3.2A
N$24
  Top 0.305: F2.2 26.15,46.1 U$3.5B
N$25
  Top 0.305: U$3.1A 47.9,62.69 F3.2
N$26
  Top 0.305: U3.1 52.08,59.5 U$4.9B
N$27
  Top 0.305: U3.2 55.06,54.13 56.4,55.47 56.4,62.47 U$4.8B
N$28
  Top 0.305: U3.4 50,53.96 50,64.13 50.86,64.99 53.89,64.99 56.28,67.38 U$4.8A
N$29
  Top 0.305: U$4.9A 52.08,67.28 49.25,64.44 49.25,52.17 U3.5
N$30
  Top 0.305: U3.15 64.68,55.98 U$4.6B
N$31
  Top 0.305: U3.14 66.54,55.3 66.54,66.23 U$4.6A
N$32
  Top 0.305: U3.13 60.91,50.67 60.91,62.16 U$4.7B
N$33
  Top 0.305: U$4.7A 60.48,66 58.63,64.15 58.63,50.41 U3.12
N$34
  Top 0.305: U$4.5B 68.88,46.55 F4.2
N$35
  Top 0.305: U4.1 73.08,60.09 U$4.4B
N$36
  Top 0.305: U4.2 70.73,59.9 70.73,64.15 68.88,66 U$4.5A
N$37
  Top 0.305: U4.4 77.99,50.24 77.99,58.47 77.01,59.45 76.16,59.45 74.98,60.63 74.98,66.19 U$4.4A
N$38
  Top 0.305: U$4.3B 77.28,60.25 78.75,58.78 78.75,48.45 U4.5
N$39
  Top 0.305: U4.15 83.83,53.98 81.48,56.33 U$4.2B
N$40
  Top 0.305: U4.14 85.68,52.85 U$4.1B
N$41
  Top 0.305: U4.13 84.27,49.54 87.56,52.83 87.56,64.28 86.46,65.38 82.93,65.38 81.48,66.83 U$4.2A
N$42
  Top 0.305: U4.12 79.5,51.13 79.5,63.78 77.28,66 U$4.3A
N$43
  Top 0.305: U$4.1A 88.64,65.13 88.64,47.47 90.68,45.43 F5.2
N$44
  Top 0.305: U5.1 94.51,60.25 U$5.9B
N$45
  Top 0.305: U5.2 99.92,55.66 99.92,61.38 U$5.8B
N$46
  Top 0.305: U5.4 92.36,54.78 92.36,64.13 93.71,65.48 97.22,65.48 98.71,66.97 U$5.8A
N$47
  Top 0.305: U$5.9A 94.51,67.35 91.61,64.44 91.61,52.99 U5.5
N$48
  Top 0.305: U5.15 107.63,55.75 107.63,62.07 U$5.6B
N$49
  Top 0.305: U$5.6A 107.11,66 108.96,64.15 108.96,54.54 U5.14
N$50
  Top 0.305: U5.13 102.91,51.85 U$5.7B
N$51
  Top 0.305: U$5.7A 102.91,66 101.06,64.15 101.06,51.16 U5.12
N$52
  Top 0.305: U$5.5B 114.19,59.71 121.2,59.71 F6.2
N$53
  Top 0.5: U$1.14 96.32,25.7 91.9,21.28 91.9,5.43 89.22,2.75 U9.14
OSC_N
  Top 0.305: C5.2 73.03,32.03 Y1.1 66.42,32.03 65.51,31.12 65.51,28.65 U7.8
OSC_P
  Top 0.305: C4.2 73.06,27.16 Y1.2 65.14,23.71 U7.7
RXCAN
  Bottom 0.5: U8.2 68.42,16.32 U7.2
S0
  Top 0.305: U5.11 104.59,43.82 102.05,41.28 102.05,37.83 100.14,35.93 89.98,35.93 88.08,37.83 88.08,41.28 85.54,43.82 U4.11 83,43.82 80.46,41.28 80.46,36.83 78.56,34.93 68.39,34.93 66.49,36.83 66.49,41.28 63.95,43.82 U3.11 61.41,43.82 58.87,41.28 58.87,36.83 56.97,34.93 46.8,34.93 44.9,36.83 44.9,41.28 42.36,43.82 U2.11 39.82,43.82 37.28,41.28 37.28,36.83 35.38,34.93 25.21,34.93 23.31,36.83 23.31,41.28 20.77,43.82 U1.11 18.23,43.82 16.32,41.91 16.32,35.89 22.04,30.18 27.8,30.18 29.02,28.96 U6.8
S1
  Top 0.305: U5.10 104.59,41.28 102.61,39.3 102.61,37.6 100.3,35.29 89.83,35.29 87.44,37.68 87.44,39.37 85.54,41.28 U4.10 83,41.28 81.02,39.3 81.02,36.6 78.71,34.29 68.24,34.29 65.93,36.6 65.93,39.3 63.95,41.28 U3.10 61.41,41.28 59.43,39.3 59.43,36.6 57.12,34.29 46.65,34.29 44.27,36.68 44.27,39.37 42.36,41.28 U2.10 39.82,41.28 37.84,39.3 37.84,36.6 35.53,34.29 25.06,34.29 22.68,36.68 22.68,39.37 20.77,41.28 U1.10 18.23,41.28 16.96,40.01 16.96,36.04 22.19,30.81 29.71,30.81 31.57,28.96 U6.7
S2
  Top 0.305: U5.9 103.8,38.74 103.17,38.1 103.17,37.32 100.53,34.68 89.6,34.68 85.54,38.74 U4.9 82.21,38.74 81.58,38.1 81.58,36.37 78.94,33.73 68.01,33.73 65.37,36.37 65.37,37.32 63.95,38.74 U3.9 60.62,38.74 59.99,38.1 59.99,36.37 57.35,33.73 46.42,33.73 43.71,36.45 43.71,37.39 42.36,38.74 U2.9 39.03,38.74 38.4,38.1 38.4,36.37 35.76,33.73 24.83,33.73 22.12,36.45 22.12,37.39 20.77,38.74 U1.9 18.86,38.74 17.59,37.47 17.59,36.2 22.42,31.37 32.32,31.37 34.1,29.59 U6.6
TXCAN
  Bottom 0.5: U8.3 78.42,18.86 79.11,18.17 79.11,15.77 78.31,14.97 69.61,14.97 U7.1
VCC  (via drill 0.4)
  Top 0.406: R1.2 R2.2 R3.2 R4.2 R5.2 R6.1 50.41,3.3 v50.44,3.33
  Top 0.5: v57.31,3.37 59.01,5.07 59.01,6.47 57.01,8.47 U7.18 | v25.31,3.37 35.04,3.37 R1.2
  Bottom 0.5: U1.16 21.3,58.32 | 21.3,58.32 42.89,58.32 | 42.89,58.32 64.48,58.32 | 64.48,58.32 86.07,58.32 | 86.07,58.32 107.66,58.32 | U2.16 42.89,58.32 | U3.16 64.48,58.32 | U4.16 86.07,58.32 | U5.16 107.66,58.32 | v50.44,3.33 57.27,3.33 v57.31,3.37 | 21.3,58.32 8.76,58.32 6.21,55.77 6.21,10.27 13.11,3.37 v25.31,3.37 | 107.66,58.32 113.36,58.32 120.71,50.97 120.71,39.07 120.05,38.41 117.33,38.41 U$1.6 116.8,37.88 C7.1

### Text on the board
tPlace: 8 | GND | 9 | 18 | GND | 19 | 27 | GND | 28 | 36 | GND | 37 | 1 | TRACTIVE SIDE | AMS TempBoard / V3.0 Isolated | GLV SIDE | CANL | CANH | 12V | GND | AET | Notes for technical Inspection: / - GLV side is on the CAN / 12V input to the board / - Traction side includes the nano, / multiplexers and temp sense lines / - DCDC converters have 1kV isolation / - CAN transciever has 2.5kVrms isolation | 12V Isolated
bPlace: mm | 5V Isolated | CAN LO | CAN HI